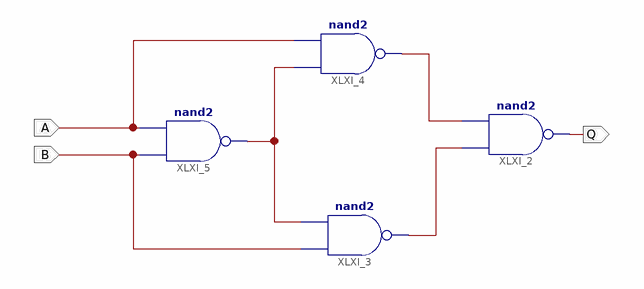
[diagram p0: schematic sheet 1]
// Xilinx ISE schematic Lab4Exp1.sch (spartan3e) as structural Verilog: 4 symbols, 3 ports
module Lab4Exp1 (
  input  A,
  input  B,
  output Q
);

  wire XLXN_7, XLXN_8, XLXN_9;

  nand XLXI_2 (Q, XLXN_9, XLXN_8);
  nand XLXI_3 (XLXN_9, B, XLXN_7);
  nand XLXI_4 (XLXN_8, XLXN_7, A);
  nand XLXI_5 (XLXN_7, B, A);
endmodule
